# EAGLE design NE555_sample (EAGLE 9.6.0)
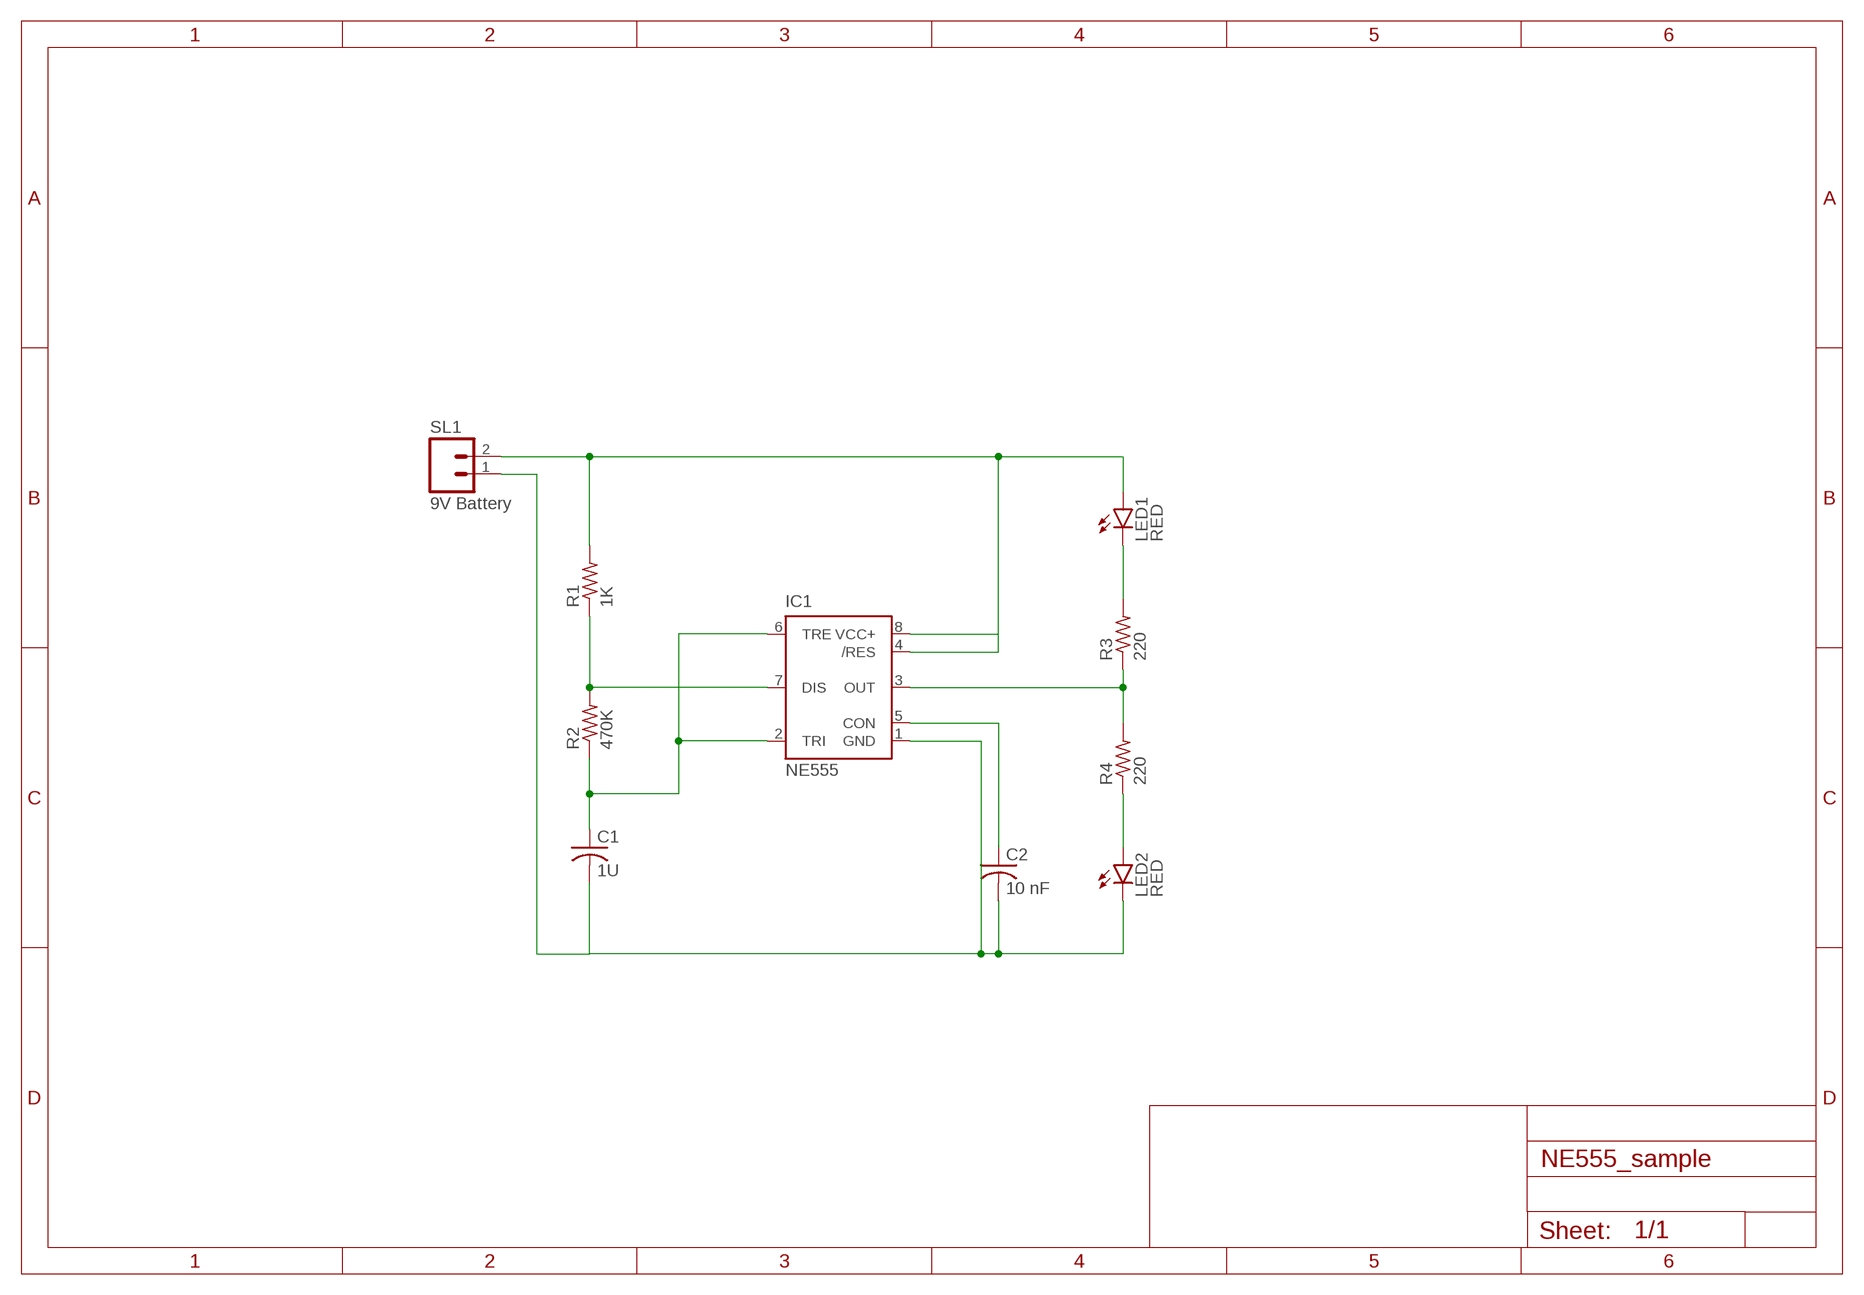
[diagram p0: schematic, sheet 1]

## Parts
C1  1U  C-USC0805  [C0805]
C2  10 nF  C-USC0805  [C0805]
IC1  NE555  [DIL-08]
LED1  RED  LEDCHIPLED_0805  [CHIPLED_0805]
LED2  RED  LEDCHIPLED_0805  [CHIPLED_0805]
R1  1K  R-US_R0805  [R0805]
R2  470K  R-US_R0805  [R0805]
R3  220  R-US_R0805  [R0805]
R4  220  R-US_R0805  [R0805]
SL1  9V Battery  M02  [02P]

## Nets
N$1: IC1.4(/RES) IC1.8(VCC+) LED1.A R1.2 SL1.2
N$2: LED1.C R3.2
N$3: IC1.3(OUT) R3.1 R4.2
N$4: LED2.A R4.1
N$5: C1.2 C2.2 IC1.1(GND) LED2.C SL1.1
N$6: C1.1 IC1.2(TRI) IC1.6(TRE) R2.1
N$7: IC1.7(DIS) R1.1 R2.2
N$8: C2.1 IC1.5(CON)

## Library data of the parts
C1 C2 = rcl:C-US: CAPACITOR, American symbol; SPICEPREFIX: C
IC1 = st-microelectronics:NE555: General purpose bipolar Timer; MF: Arrow Electronics; MPN: NE555N; OC_FARNELL: 1467742; OC_NEWARK: 89K1486
LED1 LED2 = led:LED: LED OSRAM: - CHIPLED LG R971, LG N971, LY N971, LG Q971, LY Q971, LO R971, LY R971 LH N974, LH R974 LS Q976, LO Q976, LY Q976 LO Q996 - Hyper CHIPLED LW Q18S LB Q993, LB Q99A, LB R99A - SideLED LS A670, LO A670, LY A670, LG A670, LP A670 LB A673, LV A673, LT A673, LW A673 LH A674 LY A675 LS A676, LA A676, LO A676, LY A676, LW A676 LS A679, LY A679, LG A679 - Hyper Micro SIDELED® LS Y876, LA Y876, LO Y876, LY Y876 LT Y87S - SmartLED LW L88C, LW L88S LB L89C, LB L89S, LG L890 LS L89K, LO L89K, LY L89K LS L896, LA L896, LO L896, LY L896 - TOPLED LS T670, LO T670, LY T670, LG T670, LP T670 LSG T670, LSP T670, LSY T670, LOP T670, LYG T670 LG T671, LOG T671, LSG T671 LB T673, LV T673, LT T673, LW T673 LH T674 LS T676, LA T676, LO T676, LY T676, LB T676, LH T676, LSB T676, LW T676 LB T67C, LV T67C, LT T67C, LS T67K, LO T67K, LY T67K, LW E67C LS E67B, LA E67B, LO E67B, LY E67B, LB E67C, LV E67C, LT E67C LW T67C LS T679, LY T679, LG T679 LS T770, LO T770, LY T770, LG T770, LP T770 LB T773, LV T773, LT T773, LW T773 LH T774 LS E675, LA E675, LY E675, LS T675 LS T776, LA T776, LO T776, LY T776, LB T776 LHGB T686 LT T68C, LB T68C - Hyper Mini TOPLED® LB M676 - Mini TOPLED Santana® LG M470 LS M47K, LO M47K, LY M47K Source: http://www.osram.convergy.de LUXEON: - LUMILED® LXK2-PW12-R00, LXK2-PW12-S00, LXK2-PW14-U00, LXK2-PW14-V00 LXK2-PM12-R00, LXK2-PM12-S00, LXK2-PM14-U00 LXK2-PE12-Q00, LXK2-PE12-R00, LXK2-PE12-S00, LXK2-PE14-T00, LXK2-PE14-U00 LXK2-PB12-K00, LXK2-PB12-L00, LXK2-PB12-M00, LXK2-PB14-N00, LXK2-PB14-P00, LXK2-PB14-Q00 LXK2-PR12-L00, LXK2-PR12-M00, LXK2-PR14-Q00, LXK2-PR14-R00 LXK2-PD12-Q00, LXK2-PD12-R00, LXK2-PD12-S00 LXK2-PH12-R00, LXK2-PH12-S00 LXK2-PL12-P00, LXK2-PL12-Q00, LXK2-PL12-R00 Source: www.luxeon.com KINGBRIGHT: KA-3528ASYC Source: www.kingbright.com
R1-R4 = rcl:R-US_: RESISTOR, American symbol; SPICEPREFIX: R
SL1 = con-amp-quick:M02: AMP QUICK CONNECTOR; OC_FARNELL: unknown; OC_NEWARK: unknown

## Board
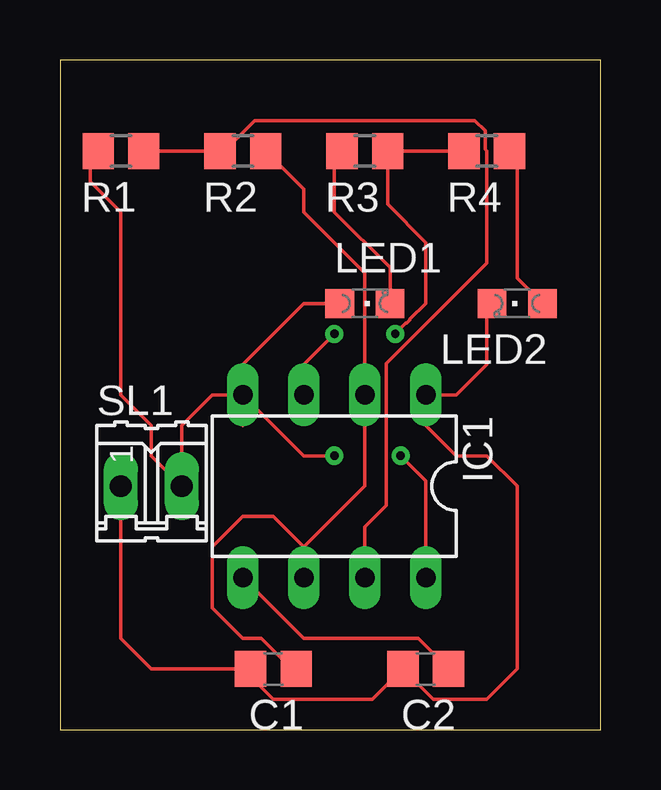
[diagram p1: board, top side]
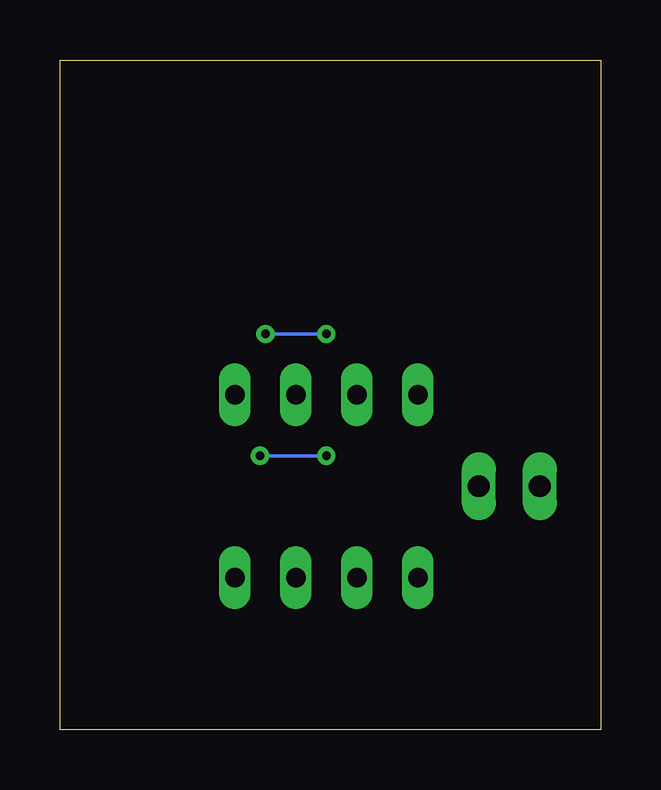
[diagram p2: board, bottom side, seen from below]

Size 22.53 x 27.93 mm. Coordinates in mm from the lower left corner, seen from the top.
Outline: 0,0 22.53,0 22.53,27.93 0,27.93 0,0
Copper layers (1*16): Top 0.035mm / dielectric 1.5mm / Bottom 0.035mm
Design rules "default": minimum track width 6mil, minimum drill 0.35mm, track to track 6mil, track to pad 6mil, pad to pad 6mil, via to via 6mil, smd to smd 6mil, copper to edge 40mil, drill to drill 6mil, minimum pad ring 10mil, minimum via ring 8mil, stop-mask expansion 4mil, vias tented up to drill 0mil, thermal gap 10mil

### Footprints (pad centres in the part's own frame; a part is rotated, then mirrored left to right if it is on the bottom)
C0805 = smd 1.3 x 1.5: 1 -0.95,0; 2 0.95,0
DIL-08 = drill 0.813 long: 1 -3.81,-3.81; 2 -1.27,-3.81; 3 1.27,-3.81; 4 3.81,-3.81; 5 3.81,3.81; 6 1.27,3.81; 7 -1.27,3.81; 8 -3.81,3.81
CHIPLED_0805 = smd 1.2 x 1.2: A 0,-1.05; C 0,1.05
R0805 = smd 1.3 x 1.5: 1 -0.95,0; 2 0.95,0
02P = drill 0.914 long: 1 -1.27,0; 2 1.27,0

### Placement (x,y rotation side)
C1  8.89,2.54 180 top
C2  15.24,2.54 180 top
IC1  11.43,10.16 180 top
LED1  12.7,17.78 270 top
LED2  19.05,17.78 90 top
R1  2.54,24.13 180 top
R2  7.62,24.13 180 top
R3  12.7,24.13 180 top
R4  17.78,24.13 180 top
SL1  3.81,10.16 0 top

### Tracks (layer width: path | path; a pad name or v marks a point on that pad's centre or on a via)
N$1  (via drill 0.35)
  Top 0.152: 7.62,12.7 IC1.4 | IC1.4 6.35,13.97 5.08,12.7 SL1.2 3.81,11.43 3.81,12.7 2.54,13.97 2.54,21.59 1.27,22.86 1.27,23.81 R1.2 | LED1.A 10.16,17.78 7.62,15.24 IC1.4 | IC1.4 10.16,11.43 v11.43,11.43 | v14.2,11.43 15.24,10.39 IC1.8
  Bottom 0.152: v11.43,11.43 v14.2,11.43
N$2
  Top 0.152: LED1.C 13.75,19.27 11.43,21.59 11.43,23.81 R3.2
N$3  (via drill 0.35)
  Top 0.152: R4.2 R3.1 13.65,21.91 15.24,20.32 15.24,17.78 14.58,17.12 14.58,17.09 14.45,16.95 14.41,16.95 v13.97,16.51 | IC1.3 10.16,15.24 v11.43,16.51
  Bottom 0.152: v11.43,16.51 v13.97,16.51
N$4
  Top 0.152: R4.1 19.05,24.13 19.05,18.83 LED2.A
N$5
  Top 0.152: SL1.1 2.54,3.81 3.81,2.54 7.62,2.54 | 7.62,2.54 C1.2 | LED2.C 17.78,17.56 17.78,15.24 16.51,13.97 IC1.1 15.24,12.7 16.51,11.43 17.78,11.43 19.05,10.16 19.05,2.54 17.78,1.27 15.56,1.27 C2.2 13.02,1.27 8.89,1.27 7.62,2.54
N$6
  Top 0.152: C1.1 9.66,2.54 8.39,3.81 7.62,3.81 6.35,5.08 6.35,7.62 7.62,8.89 8.89,8.89 10.16,7.62 | 10.16,7.62 IC1.6 | R2.1 10.16,22.54 10.16,21.59 12.7,19.05 IC1.2 12.7,10.16 10.16,7.62
N$7
  Top 0.152: R1.1 R2.2 6.85,24.13 8.12,25.4 17.28,25.4 17.71,24.98 17.71,24.2 17.78,24.13 17.78,19.46 13.59,15.27 13.59,9.35 12.7,8.46 IC1.7
N$8
  Top 0.152: C2.1 14.92,3.81 10.16,3.81 IC1.5